# EAGLE design bottom.bpcb (EAGLE 5.04)
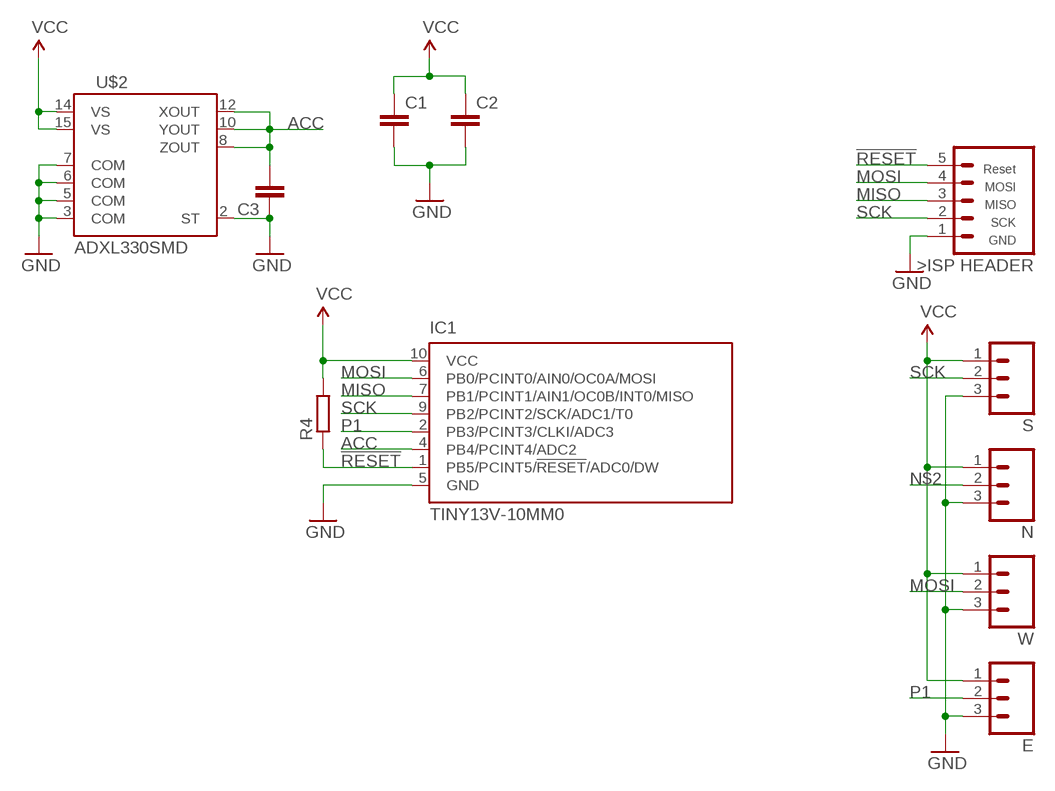
[diagram p0: schematic, sheet 1]

## Parts
C1  C-EUC0603  [C0603]
C2  C-EUC0603  [C0603]
C3  C-EUC0603  [C0603]
E  M03LOCK  [1X03_LOCK]
IC1  TINY13V-10MM0  [10M1]
N  M03LOCK  [1X03_LOCK]
R4  R-EU_R0603  [R0603]
S  M03LOCK  [1X03_LOCK]
U$1  ISPHEADER  [1X05]
U$2  ADXL330SMD  [LFCSP-16]
W  M03LOCK  [1X03_LOCK]

## Nets
!RESET: IC1.1(PB5/PCINT5/!RESET!/ADC0/DW) R4.1 U$1.5(RST)
ACC: C3.2 IC1.4(PB4/PCINT4/ADC2) U$2.8(ZOUT) U$2.10(YOUT) U$2.12(XOUT)
GND: C1.2 C2.2 C3.1 E.3 IC1.5(GND) N.3 S.3 U$1.1(GND) U$2.2(ST) U$2.3(COM) U$2.5(COM) U$2.6(COM) U$2.7(COM) W.3
MISO: IC1.7(PB1/PCINT1/AIN1/OC0B/INT0/MISO) U$1.3(MISO)
MOSI: IC1.6(PB0/PCINT0/AIN0/OC0A/MOSI) U$1.4(MOSI) W.2
N$2: N.2
P1: E.2 IC1.2(PB3/PCINT3/CLKI/ADC3)
SCK: IC1.9(PB2/PCINT2/SCK/ADC1/T0) S.2 U$1.2(SCK)
VCC: C1.1 C2.1 E.1 IC1.10(VCC) N.1 R4.2 S.1 U$2.14(VS) U$2.15(VS) W.1

## Power pins joined to a net without a drawn wire
GND: IC1.11(GND)

## Library data of the parts
C1-C3 = resistor:C-EU: CAPACITOR, European symbol
E N S W = SparkFun:M03: Header 3 Standard 3-pin 0.1" header. Use with straight break away headers (SKU : PRT-00116), right angle break away headers (PRT-00553), swiss pins (PRT-00743), machine pins (PRT-00117), and female headers (PRT-00115). Molex polarized connector foot print use with SKU : PRT-08232 with associated crimp pins and housings.
IC1 = additional:TINY13*: 8-bit AVR Microcontroller with 1K Bytes In-System Programmable Flash Source: http://www.atmel.com/dyn/resources/prod_documents/2535S.pdf
R4 = resistor:R-EU_: RESISTOR, European symbol
U$1 = tuxgraphics:ISPHEADER: ISP Header for tuxgraphics.org AvrUsb500 programmer
U$2 = SparkFun:ADXL330: Triple Axis Accelerometer Analog Devices ADXL330 +/-3g 2.4V-5.25V Analog output. Spark Fun Electronics SKU : COM-00730. Center pad paste layer has been reduced to avoid shorting.

## Board
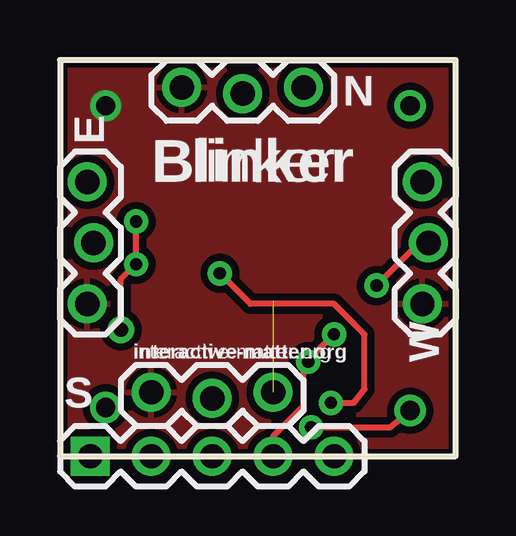
[diagram p1: board, top side]
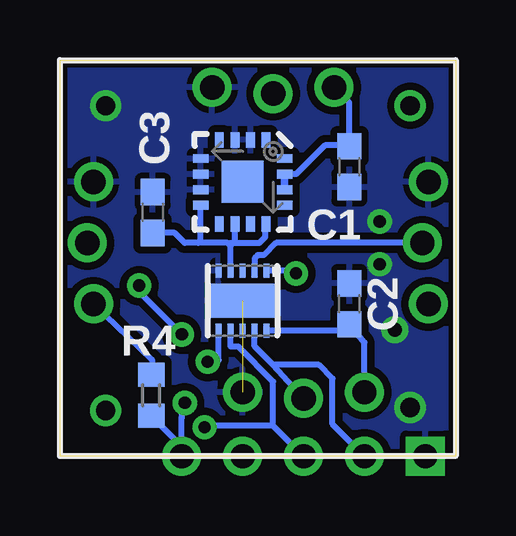
[diagram p2: board, bottom side, seen from below]

Size 16.51 x 16.51 mm. Coordinates in mm from the lower left corner, seen from the top.
Outline: 0,0 16.51,0 16.51,16.51 0,16.51 0,0
Copper layers (1*16): Top 0.035mm / dielectric 1.5mm / Bottom 0.035mm
Design rules "SparkFun": minimum track width 8mil, minimum drill 20mil, track to track 8mil, track to pad 8mil, pad to pad 8mil, via to via 8mil, smd to smd 0mil, copper to edge 10mil, drill to drill 8mil, minimum pad ring 12mil, minimum via ring 10mil, stop-mask expansion 4mil, vias tented up to drill 25mil, thermal gap 10mil

### Footprints (pad centres in the part's own frame; a part is rotated, then mirrored left to right if it is on the bottom)
C0603 = smd 1.1 x 1: 1 -0.85,0; 2 0.85,0
1X03_LOCK = drill 1.016 round: 1 0,0.127; 2 2.54,-0.127; 3 5.08,0.127
10M1 = smd 0.6 x 0.25: 1 -1.25,1; 2 -1.25,0.5; 3 -1.25,0; 4 -1.25,-0.5; 5 -1.25,-1; 6 1.25,-1; 7 1.25,-0.5; 8 1.25,0; 9 1.25,0.5; 10 1.25,1 | smd 1.4 x 2.7: 11 0,0
R0603 = smd 1 x 1.1: 1 -0.85,0; 2 0.85,0
1X05 = drill 1.016 square: 1 0,0 | drill 1.016 round: 2 2.54,0; 3 5.08,0; 4 7.62,0; 5 10.16,0
LFCSP-16 = smd 1.75 x 1.75: 0 0,0 | smd 0.65 x 0.37: 1 -1.75,0.975; 2 -1.75,0.325; 3 -1.75,-0.325; 4 -1.75,-0.975; 9 1.75,-0.975; 10 1.75,-0.325; 11 1.75,0.325; 12 1.75,0.975 | smd 0.37 x 0.65: 5 -0.975,-1.75; 6 -0.325,-1.75; 7 0.325,-1.75; 8 0.975,-1.75; 13 0.975,1.75; 14 0.325,1.75; 15 -0.325,1.75; 16 -0.975,1.75

### Placement (x,y rotation side)
C1  4.45,12.06 270 bottom
C2  4.45,6.35 90 bottom
C3  12.64,10.16 270 bottom
E  1.27,6.35 90 top
IC1  8.89,6.48 270 bottom
N  5.08,15.24 0 top
R4  12.7,2.54 90 bottom
S  3.81,2.54 0 top
U$1  1.27,0 0 top
U$2  8.89,11.43 270 bottom
W  15.24,6.35 90 top

### Tracks (layer width: path | path; a pad name or v marks a point on that pad's centre or on a via)
!RESET  (via drill 0.51)
  Top 0.254: v6.67,7.62 7.94,6.35 11.43,6.35 12.7,5.08 12.7,2.79 12.26,2.22 v11.3,2.22
  Bottom 0.254: R4.1 11.43,0.42 U$1.5 11.43,1.59 v11.3,2.22 | v6.67,7.62 6.77,7.73 IC1.1
ACC
  Bottom 0.254: 9.21,8.89 8.19,8.89 7.94,9.14 7.94,9.66 U$2.12 | 9.21,8.89 9.4,8.89 9.39,8.88 9.39,8.76 | U$2.10 9.21,8.9 9.21,8.89 | IC1.4 9.39,8.76 | C3.2 11.72,9.31 11.3,8.89 10.73,8.89 | 10.73,8.89 9.52,8.89 9.39,8.76 | U$2.8 10.64,8.98 10.73,8.89
GND  (via drill 0.51, 0.6, 0.8)  (1 unrouted)
  Top 0.254: v3.17,9.78 v3.17,8 2.54,7.37 2.54,5.65 v2.54,5.27
  other vias: 14.61,14.61 1.91,2.03
  pour Bottom (isolate 0.305): -0.25,16.64 18.03,16.7 18.1,-0.19 -0.19,-0.19
MISO  (via drill 0.51, 0.8)
  Top 0.254: v14.61,1.91 13.78,1.21 v10.48,1.21
  Bottom 0.254: IC1.7 9.39,4.56 9.07,4.56 7.62,3.11 7.62,1.27 | U$1.3 7.62,1.27 | v10.48,1.21 10.41,1.27 7.62,1.27
MOSI  (via drill 0.51)
  Top 0.254: v13.21,7.11 14.99,8.89 W.2 | v11.43,5.08 10.41,4.06 v10.35,3.94 10.16,3.49 10.16,2.1 8.89,0.83 U$1.4
  Bottom 0.254: IC1.6 9.89,4.02 10.1,3.81 10.1,3.75 v10.35,3.94 | v11.43,5.08 13.21,6.86 v13.21,7.11
P1
  Bottom 0.254: E.2 7.49,8.89 8,8.38 8.26,8.38 8.39,8.25 IC1.2
SCK
  Bottom 0.254: IC1.9 8.39,4.58 7.62,3.81 | 7.62,3.81 5.71,3.81 5.14,3.24 5.14,1.33 U$1.2 | 7.62,3.81 S.2
VCC  (via drill 0.8)
  Bottom 0.254: U$2.15 6.66,11.76 5.46,12.95 4.48,12.95 C1.1 4.45,14.73 N.1 | IC1.10 4.84,5.23 C2.1 3.81,4.74 S.1 | R4.2 12.68,4.03 W.1
  Bottom 0.305: U$2.15 U$2.14
  other vias: 1.91,14.61
  pour Top (isolate 0.305): -0.25,16.76 16.76,16.76 16.76,-0.25 -0.25,-0.25

### Text on the board
tNames: Blinker | interactive-matter.org
_tsilk: N | E | Blinker | interactive-matter.org | W | S
_bsilk: C3 | C1 | C2 | R4